# Altium schematic sheet Sheet1.SchDoc
size A4
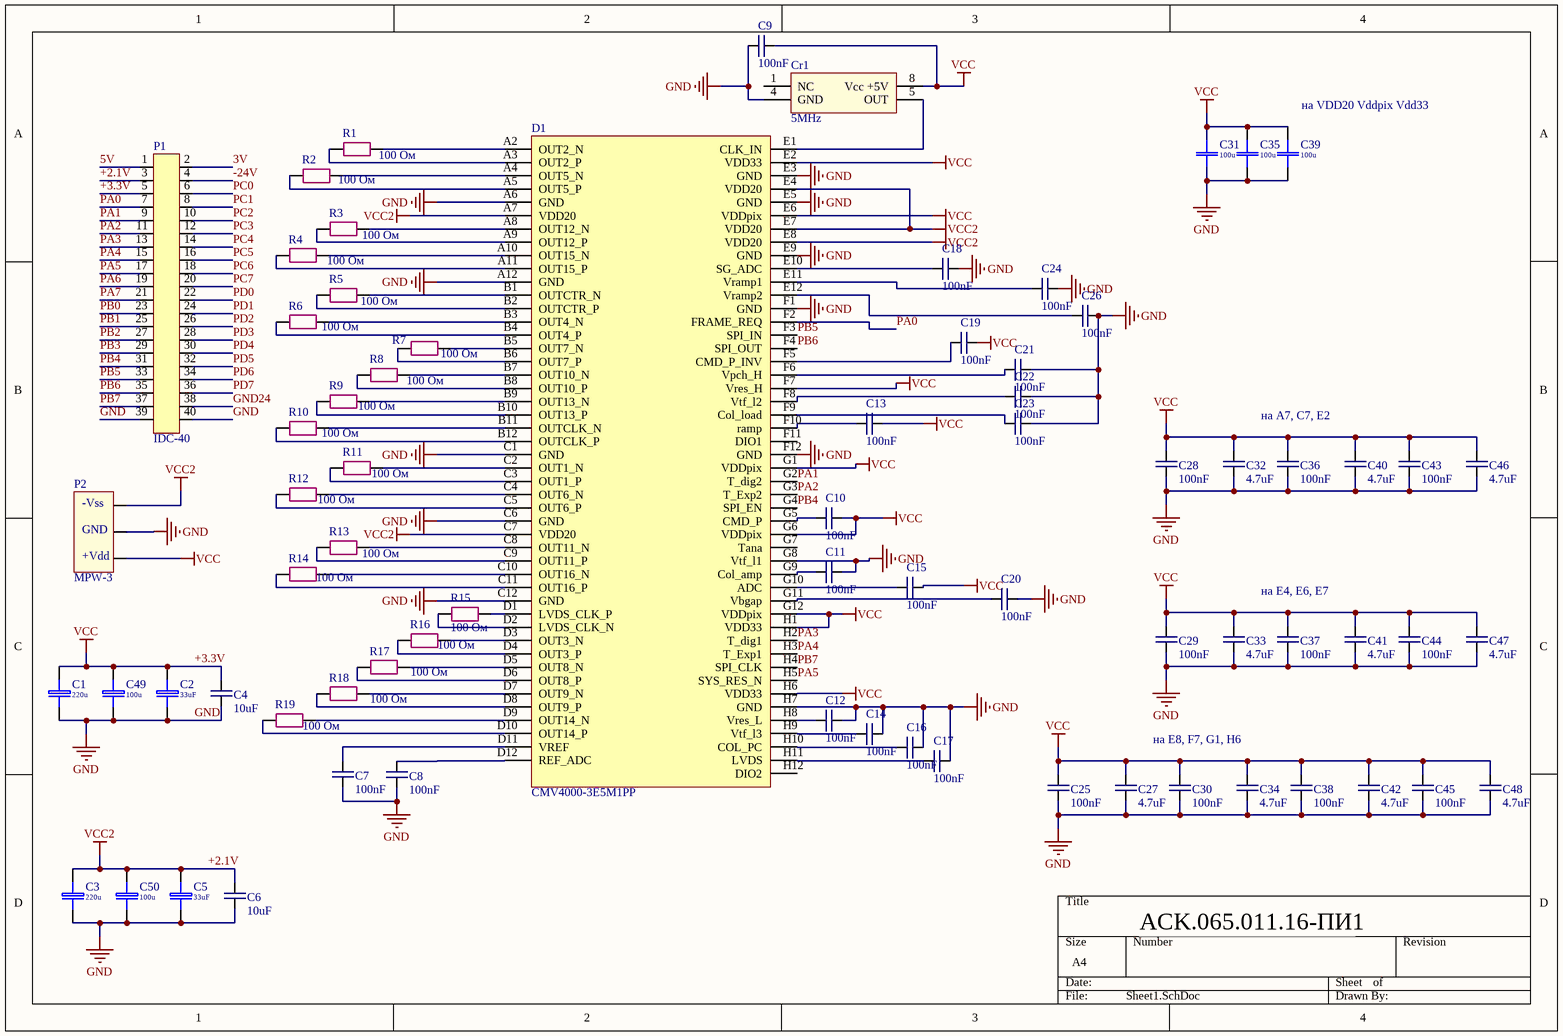
[diagram p0: Sheet1.SchDoc]

## Parts
C1  220u  [EL SMD Case D D6.3x6.6 h7.7(0605)]
C2  33uF  [EL Case B (3528-21)]
C3  220u  [EL SMD Case D D6.3x6.6 h7.7(0605)]
C4  10uF  [C_0805]
C5  33uF  [EL Case B (3528-21)]
C6  10uF  [C_0805]
C7  100nF  [C_0805]
C8  100nF  [C_0805]
C9  100nF  [C_0805]
C10  100nF  [C_0805]
C11  100nF  [C_0805]
C12  100nF  [C_0805]
C13  100nF  [C_0805]
C14  100nF  [C_0805]
C15  100nF  [C_0805]
C16  100nF  [C_0805]
C17  100nF  [C_0805]
C18  100nF  [C_0805]
C19  100nF  [C_0805]
C20  100nF  [C_0805]
C21  100nF  [C_0805]
C22  100nF  [C_0805]
C23  100nF  [C_0805]
C24  100nF  [C_0805]
C25  100nF  [C_0805]
C26  100nF  [C_0805]
C27  4.7uF  [C_0805]
C28  100nF  [C_0805]
C29  100nF  [C_0805]
C30  100nF  [C_0805]
C31  100u  [C1206(3216)]
C32  4.7uF  [C_0805]
C33  4.7uF  [C_0805]
C34  4.7uF  [C_0805]
C35  100u  [C1206(3216)]
C36  100nF  [C_0805]
C37  100nF  [C_0805]
C38  100nF  [C_0805]
C39  100u  [C1206(3216)]
C40  4.7uF  [C_0805]
C41  4.7uF  [C_0805]
C42  4.7uF  [C_0805]
C43  100nF  [C_0805]
C44  100nF  [C_0805]
C45  100nF  [C_0805]
C46  4.7uF  [C_0805]
C47  4.7uF  [C_0805]
C48  4.7uF  [C_0805]
C49  100u  [EL SMD Case D D6.3x6.6 h7.7(0605)]
C50  100u  [EL SMD Case D D6.3x6.6 h7.7(0605)]
Cr1  5MHz  [quarts_gen_2.54]
D1  CMV4000-3E5M1PP  [cmv4000]
P1  IDC-40  [IDC-40]
P2  MPW-3  [MPW-3]
R1  100 Ом  [R_0805]
R2  100 Ом  [R_0805]
R3  100 Ом  [R_0805]
R4  100 Ом  [R_0805]
R5  100 Ом  [R_0805]
R6  100 Ом  [R_0805]
R7  100 Ом  [R_0805]
R8  100 Ом  [R_0805]
R9  100 Ом  [R_0805]
R10  100 Ом  [R_0805]
R11  100 Ом  [R_0805]
R12  100 Ом  [R_0805]
R13  100 Ом  [R_0805]
R14  100 Ом  [R_0805]
R15  100 Ом  [R_0805]
R16  100 Ом  [R_0805]
R17  100 Ом  [R_0805]
R18  100 Ом  [R_0805]
R19  100 Ом  [R_0805]

## Nets
+2.1V: C3.1(+) C5.1(+) C6.2 C50.1(+) D1.A7(VDD20) D1.C7(VDD20) D1.E4(VDD20) D1.E7(VDD20) D1.E8(VDD20) P1.3 P2.1  [also labelled VCC2]
+3.3V: C1.1(+) C2.1(+) C4.2 C9.1 C10.1 C13.1 C15.1 C19.1 C25.1 C27.1 C28.1 C29.1 C30.1 C31.1 C32.1 C33.1 C34.1 C35.1 C36.1 C37.1 C38.1 C39.1 C40.1 C41.1 C42.1 C43.1 C44.1 C45.1 C46.1 C47.1 C48.1 C49.1(+) Cr1.8(Vcc_+5V) D1.E2(VDD33) D1.E6(VDDpix) D1.F7(Vres_H) D1.G1(VDDpix) D1.G6(VDDpix) D1.G12(VDDpix) D1.H1(VDD33) D1.H6(VDD33) P1.5 P2.3  [also labelled VCC]
GND: C1.2(-) C2.2(-) C3.2(-) C4.1 C5.2(-) C6.1 C7.1 C8.2 C9.2 C11.1 C12.1 C14.1 C16.1 C17.1 C18.1 C20.1 C21.1 C22.1 C23.1 C24.1 C25.2 C26.1 C27.2 C28.2 C29.2 C30.2 C31.2 C32.2 C33.2 C34.2 C35.2 C36.2 C37.2 C38.2 C39.2 C40.2 C41.2 C42.2 C43.2 C44.2 C45.2 C46.2 C47.2 C48.2 C49.2(-) C50.2(-) Cr1.4(GND) D1.A6(GND) D1.A12(GND) D1.C1(GND) D1.C6(GND) D1.C12(GND) D1.E3(GND) D1.E5(GND) D1.E9(GND) D1.F1(GND) D1.F12(GND) D1.G8(Vtf_l1) D1.H7(GND) P1.39 P1.40 P2.2
3V: P1.2
5V: P1.1
-24V: P1.4
GND24: P1.38
PA0: D1.F2(FRAME_REQ) P1.7
PA1: D1.G2(T_dig2) P1.9
PA2: D1.G3(T_Exp2) P1.11
PA3: D1.H2(T_dig1) P1.13
PA4: D1.H3(T_Exp1) P1.15
PA5: D1.H5(SYS_RES_N) P1.17
PA6: P1.19
PA7: P1.21
PB0: P1.23
PB1: P1.25
PB2: P1.27
PB3: P1.29
PB4: D1.G4(SPI_EN) P1.31
PB5: D1.F3(SPI_IN) P1.33
PB6: D1.F4(SPI_OUT) P1.35
PB7: D1.H4(SPI_CLK) P1.37
PC0: P1.6
PC1: P1.8
PC2: P1.10
PC3: P1.12
PC4: P1.14
PC5: P1.16
PC6: P1.18
PC7: P1.20
PD0: P1.22
PD1: P1.24
PD2: P1.26
PD3: P1.28
PD4: P1.30
PD5: P1.32
PD6: P1.34
PD7: P1.36
NetC7_2: C7.2 D1.D11(VREF)
NetC8_1: C8.1 D1.D12(REF_ADC)
NetC10_2: C10.2 D1.G5(CMD_P)
NetC11_2: C11.2 D1.G9(Col_amp)
NetC12_2: C12.2 D1.H8(Vres_L)
NetC13_2: C13.2 D1.F10(ramp)
NetC14_2: C14.2 D1.H9(Vtf_l3)
NetC15_2: C15.2 D1.G10(ADC)
NetC16_2: C16.2 D1.H10(COL_PC)
NetC17_2: C17.2 D1.H11(LVDS)
NetC18_2: C18.2 D1.E10(SG_ADC)
NetC19_2: C19.2 D1.F5(CMD_P_INV)
NetC20_2: C20.2 D1.G11(Vbgap)
NetC21_2: C21.2 D1.F6(Vpch_H)
NetC22_2: C22.2 D1.F8(Vtf_l2)
NetC23_2: C23.2 D1.F9(Col_load)
NetC24_2: C24.2 D1.E11(Vramp1)
NetC26_2: C26.2 D1.E12(Vramp2)
NetCr1_5: Cr1.5(OUT) D1.E1(CLK_IN)
NetD1_A2: D1.A2(OUT2_N) R1.2
NetD1_A3: D1.A3(OUT2_P) R1.1
NetD1_A4: D1.A4(OUT5_N) R2.2
NetD1_A5: D1.A5(OUT5_P) R2.1
NetD1_A8: D1.A8(OUT12_N) R3.2
NetD1_A9: D1.A9(OUT12_P) R3.1
NetD1_A10: D1.A10(OUT15_N) R4.2
NetD1_A11: D1.A11(OUT15_P) R4.1
NetD1_B1: D1.B1(OUTCTR_N) R5.2
NetD1_B2: D1.B2(OUTCTR_P) R5.1
NetD1_B3: D1.B3(OUT4_N) R6.2
NetD1_B4: D1.B4(OUT4_P) R6.1
NetD1_B5: D1.B5(OUT7_N) R7.2
NetD1_B6: D1.B6(OUT7_P) R7.1
NetD1_B7: D1.B7(OUT10_N) R8.2
NetD1_B8: D1.B8(OUT10_P) R8.1
NetD1_B9: D1.B9(OUT13_N) R9.2
NetD1_B10: D1.B10(OUT13_P) R9.1
NetD1_B11: D1.B11(OUTCLK_N) R10.2
NetD1_B12: D1.B12(OUTCLK_P) R10.1
NetD1_C2: D1.C2(OUT1_N) R11.2
NetD1_C3: D1.C3(OUT1_P) R11.1
NetD1_C4: D1.C4(OUT6_N) R12.2
NetD1_C5: D1.C5(OUT6_P) R12.1
NetD1_C8: D1.C8(OUT11_N) R13.2
NetD1_C9: D1.C9(OUT11_P) R13.1
NetD1_C10: D1.C10(OUT16_N) R14.2
NetD1_C11: D1.C11(OUT16_P) R14.1
NetD1_D1: D1.D1(LVDS_CLK_P) R15.2
NetD1_D2: D1.D2(LVDS_CLK_N) R15.1
NetD1_D3: D1.D3(OUT3_N) R16.2
NetD1_D4: D1.D4(OUT3_P) R16.1
NetD1_D5: D1.D5(OUT8_N) R17.2
NetD1_D6: D1.D6(OUT8_P) R17.1
NetD1_D7: D1.D7(OUT9_N) R18.2
NetD1_D8: D1.D8(OUT9_P) R18.1
NetD1_D9: D1.D9(OUT14_N) R19.2
NetD1_D10: D1.D10(OUT14_P) R19.1

Not connected (* = marked no-connect by the designer): Cr1 1(NC); D1 F11(DIO1) G7(Tana) H12(DIO2)

## Notes on the sheet
- (near C39) на VDD20 Vddpix Vdd33
- на A7, C7, E2
- на E4, E6, E7
- на E8, F7, G1, H6
- ACK.065.011.16-ПИ1
- (in symbol MPW-3) -Vss; GND; +Vdd

## Library data of the parts
C1 C3 C49 C50 = EL 100u/25V: EL 25V SMD Case C D6.3x6.6 h7.7; Price: 0.014
  C1 C3: Value: 220u
  C49 C50: Value: 100u
C2 C5 = EL Case B (3528-21): EL Tantalum Case B (3528-21); Price: 0.22; Value: 33uF
C4 C6-C30 C32-C34 C36-C38 C40-C48 = capacitor 0805
C31 C35 C39 = C-1206  1000V 1n: SMD-1206 1000V X7R 10%; Price: 0.33; Value: 100u
Cr1 = quarts_gen_2.54
P1 = IDC-40: разъем 2529
R1-R19 = resistor 0805